# Altium schematic sheet Sheet_1_2022-05-11.schdoc
size 242 x 182 mm
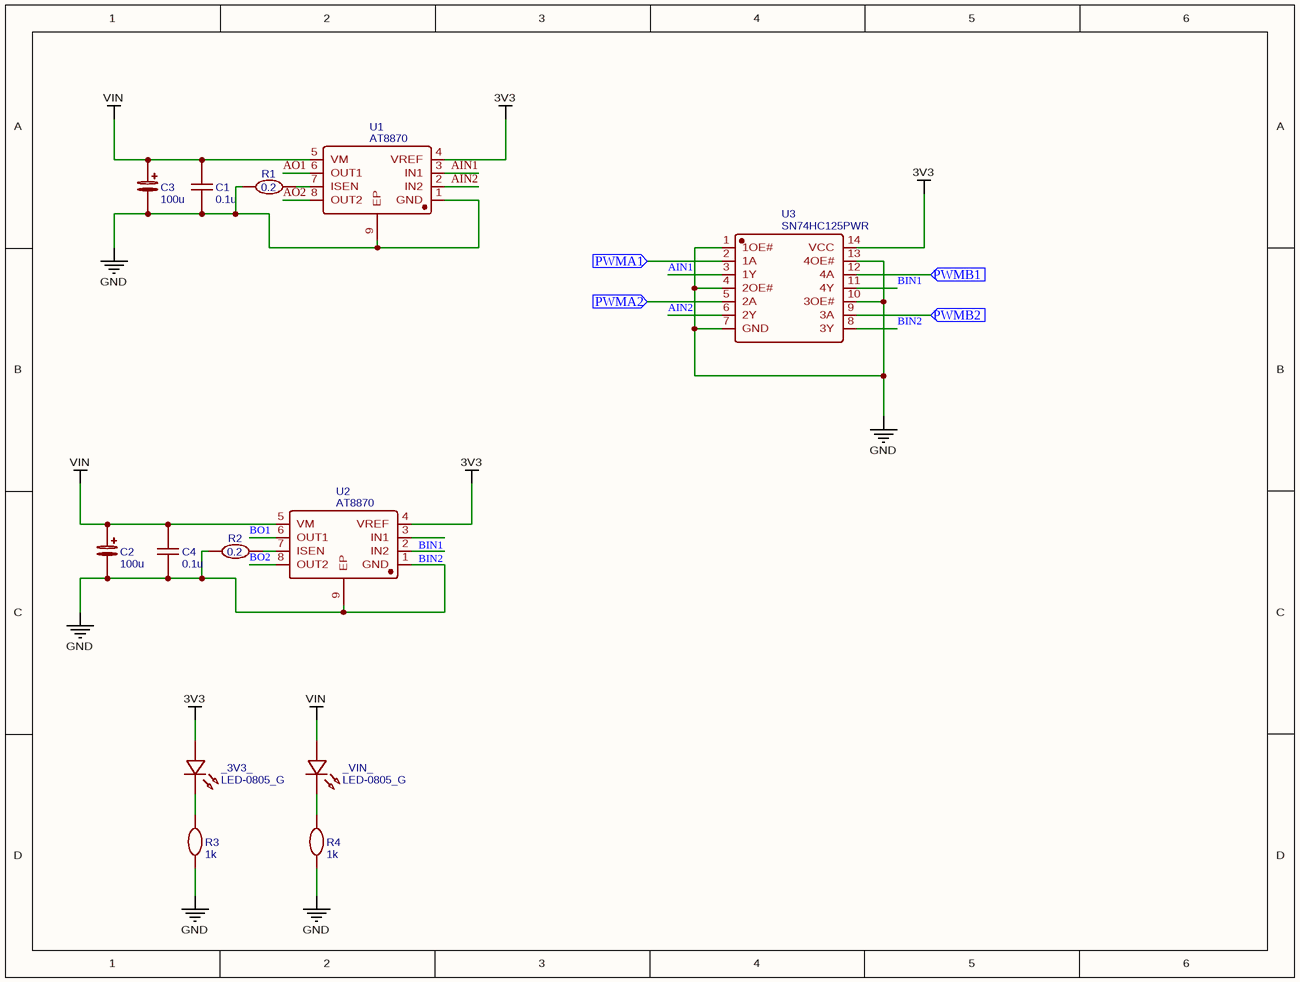
[diagram p0: Sheet_1_2022-05-11.schdoc]

## Parts
_3V3_  LED-0805_G  [LED0805_GREEN]
_VIN_  LED-0805_G  [LED0805_GREEN]
C1  0.1u  [C0603]
C2  100u  [CAP-D6.3×H5.5]
C3  100u  [CAP-D6.3×H5.5]
C4  0.1u  [C0603]
R1  0.2  [R0603]
R2  0.2  [R0603]
R3  1k  [R0603]
R4  1k  [R0603]
U1  AT8870  [SOP-8_L4.9-W3.9-P1.27-LS6.0-BL-EP]
U2  AT8870  [SOP-8_L4.9-W3.9-P1.27-LS6.0-BL-EP]
U3  SN74HC125PWR  [TSSOP-14_L5.0-W4.4-P0.65-LS6.5-BL]

## Ports
PWMA1 (in), PWMA2 (in), PWMB1 (in), PWMB2 (in)

## Nets
3V3: _3V3_.1 U1.4(VREF) U2.4(VREF) U3.14(VCC)
GND: C1.1 C2.2 C3.2 C4.1 R1.2 R2.2 R3.1 R4.1 U1.1(GND) U1.9(EP) U2.1(GND) U2.9(EP) U3.1(1OE#) U3.4(2OE#) U3.7(GND) U3.10(3OE#) U3.13(4OE#)
VIN: _VIN_.1 C1.2 C2.1 C3.1 C4.2 U1.5(VM) U2.5(VM)
AIN1: U1.3(IN1) U3.3(1Y)
AIN2: U1.2(IN2) U3.6(2Y)
AO1: U1.6(OUT1)
AO2: U1.8(OUT2)
BIN1: U2.3(IN1) U3.11(4Y)
BIN2: U2.2(IN2) U3.8(3Y)
BO1: U2.6(OUT1)
BO2: U2.8(OUT2)
PWMA1: U3.2(1A) ; port PWMA1
PWMA2: U3.5(2A) ; port PWMA2
PWMB1: U3.12(4A) ; port PWMB1
PWMB2: U3.9(3A) ; port PWMB2
Net_3V3__2: _3V3_.2 R3.2
Net_VIN__2: _VIN_.2 R4.2
NetR1_1: R1.1 U1.7(ISEN)
NetR2_1: R2.1 U2.7(ISEN)

## Library data of the parts
_3V3_ _VIN_ = LED-0805_G: BOM_Manufacturer: 国星光电; BOM_Manufacturer Part: NCD0805G1; Contributor: LCEDA_Lib; BOM_Supplier Part: C84260; spicePre: L; spiceSymbolName: LED-0805_G
C1 C4 = 0.1u: nameAlias: Value(F); Contributor: LCEDA_Lib; spicePre: C; spiceSymbolName: C_0603_US
C2 C3 = 100u: nameAlias: Value(F); Contributor: LCEDA_Lib; spicePre: C; spiceSymbolName: CE_SMD_D6.3×H5.5_EU
R1 R2 = 0.2: nameAlias: Value(Ω); Contributor: LCEDA_Lib; spicePre: R; spiceSymbolName: R_0603_EU
R3 R4 = 1k: nameAlias: Value(Ω); Contributor: LCEDA_Lib; spicePre: R; spiceSymbolName: R_0603_EU
U1 U2 = AT8870: BOM_Manufacturer: Jiaxing Heroic Elec Tech; Contributor: LCSC; BOM_Supplier: LCSC; BOM_Supplier Part: C191458; BOM_Manufacturer Part: AT8870; BOM_JLCPCB Part Class: Extended Part; spicePre: U; spiceSymbolName: AT8870
U3 = SN74HC125PWR: BOM_Manufacturer: Texas Instruments; Contributor: LCSC; BOM_Supplier: LCSC; BOM_Supplier Part: C132994; BOM_Manufacturer Part: SN74HC125PWR; BOM_JLCPCB Part Class: Extended Part; spicePre: U; spiceSymbolName: SN74HC125PWR